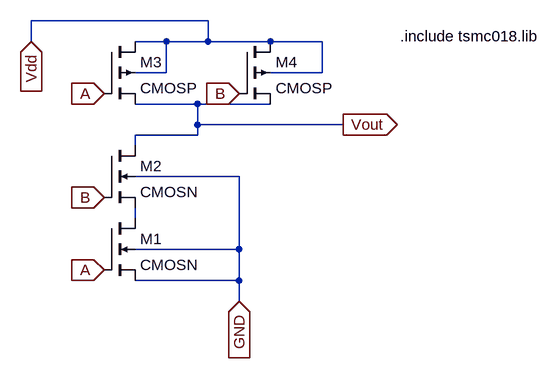
[diagram p0: schematic NAND_Gate.asc]
NAND_Gate.asc, the LTspice schematic file:
Version 4
SHEET 1 880 680
WIRE 272 -48 0 -48
WIRE 0 -16 0 -48
WIRE 208 -16 160 -16
WIRE 272 -16 272 -48
WIRE 272 -16 208 -16
WIRE 368 -16 272 -16
WIRE 448 -16 368 -16
WIRE 208 32 208 -16
WIRE 208 32 160 32
WIRE 448 32 448 -16
WIRE 448 32 368 32
WIRE 256 80 160 80
WIRE 368 80 256 80
WIRE 256 112 256 80
WIRE 480 112 256 112
WIRE 256 128 256 112
WIRE 256 128 160 128
WIRE 160 144 160 128
WIRE 320 192 160 192
WIRE 160 256 160 240
WIRE 320 304 320 192
WIRE 320 304 160 304
WIRE 320 352 320 304
WIRE 320 352 160 352
WIRE 320 384 320 352
FLAG 112 336 A
IOPIN 112 336 In
FLAG 112 224 B
IOPIN 112 224 In
FLAG 320 64 B
IOPIN 320 64 In
FLAG 112 64 A
IOPIN 112 64 In
FLAG 0 -16 Vdd
IOPIN 0 -16 In
FLAG 480 112 Vout
IOPIN 480 112 Out
FLAG 320 384 GND
IOPIN 320 384 In
SYMBOL cmosn 112 256 R0
SYMATTR InstName M1
SYMBOL cmosn 112 144 R0
SYMATTR InstName M2
SYMBOL cmosp 112 -16 R0
SYMATTR InstName M3
SYMBOL cmosp 320 -16 R0
SYMATTR InstName M4
TEXT 568 -24 Left 2 !.include tsmc018.lib

The netlist it stands for:
* NAND_Gate.asc
M1 N001 A GND GND CMOSN
M2 Vout B N001 GND CMOSN
M3 Vdd A Vout Vdd CMOSP
M4 Vdd B Vout Vdd CMOSP
.model NMOS NMOS
.model PMOS PMOS
.lib standard.mos
.include tsmc018.lib
.backanno
.end